# Altium schematic sheet mezza.SchDoc
size A1
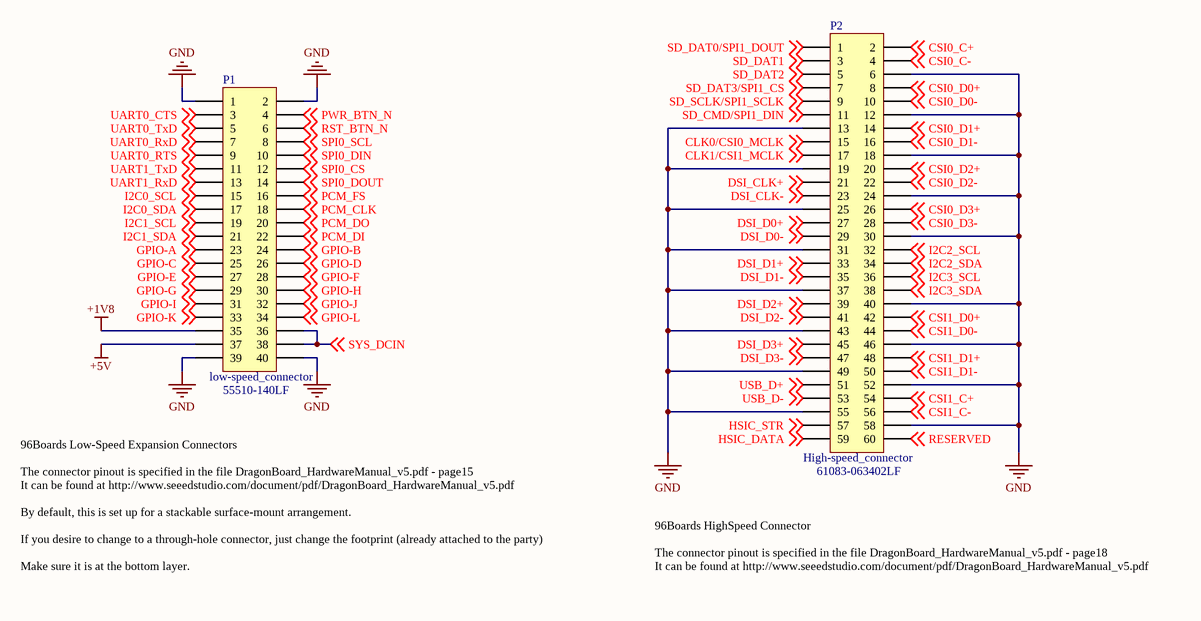
[diagram p0: mezza.SchDoc]

## Parts
P1  low-speed_connector  PartNumber: 55510-140LF  [low-speed_connector_TH]
P2  High-speed_connector  PartNumber: 61083-063402LF  [high-speed_connector]

## Nets
+1V8: P1.35
+5V: P1.37
GND: P1.1 P1.2 P1.39 P1.40 P2.6 P2.12 P2.13 P2.18 P2.19 P2.24 P2.25 P2.30 P2.31 P2.37 P2.40 P2.43 P2.46 P2.49 P2.52 P2.55 P2.58
CLK0/CSI0_MCLK: P2.15 ; off-sheet CLK0/CSI0_MCLK
CLK1/CSI1_MCLK: P2.17 ; off-sheet CLK1/CSI1_MCLK
CSI0_C+: P2.2 ; off-sheet CSI0_C+
CSI0_C-: P2.4 ; off-sheet CSI0_C-
CSI0_D0+: P2.8 ; off-sheet CSI0_D0+
CSI0_D0-: P2.10 ; off-sheet CSI0_D0-
CSI0_D1+: P2.14 ; off-sheet CSI0_D1+
CSI0_D1-: P2.16 ; off-sheet CSI0_D1-
CSI0_D2+: P2.20 ; off-sheet CSI0_D2+
CSI0_D2-: P2.22 ; off-sheet CSI0_D2-
CSI0_D3+: P2.26 ; off-sheet CSI0_D3+
CSI0_D3-: P2.28 ; off-sheet CSI0_D3-
CSI1_C+: P2.54 ; off-sheet CSI1_C+
CSI1_C-: P2.56 ; off-sheet CSI1_C-
CSI1_D0+: P2.42 ; off-sheet CSI1_D0+
CSI1_D0-: P2.44 ; off-sheet CSI1_D0-
CSI1_D1+: P2.48 ; off-sheet CSI1_D1+
CSI1_D1-: P2.50 ; off-sheet CSI1_D1-
DSI_CLK+: P2.21 ; off-sheet DSI_CLK+
DSI_CLK-: P2.23 ; off-sheet DSI_CLK-
DSI_D0+: P2.27 ; off-sheet DSI_D0+
DSI_D0-: P2.29 ; off-sheet DSI_D0-
DSI_D1+: P2.33 ; off-sheet DSI_D1+
DSI_D1-: P2.35 ; off-sheet DSI_D1-
DSI_D2+: P2.39 ; off-sheet DSI_D2+
DSI_D2-: P2.41 ; off-sheet DSI_D2-
DSI_D3+: P2.45 ; off-sheet DSI_D3+
DSI_D3-: P2.47 ; off-sheet DSI_D3-
GPIO-A: P1.23 ; off-sheet GPIO-A
GPIO-B: P1.24 ; off-sheet GPIO-B
GPIO-C: P1.25 ; off-sheet GPIO-C
GPIO-D: P1.26 ; off-sheet GPIO-D
GPIO-E: P1.27 ; off-sheet GPIO-E
GPIO-F: P1.28 ; off-sheet GPIO-F
GPIO-G: P1.29 ; off-sheet GPIO-G
GPIO-H: P1.30 ; off-sheet GPIO-H
GPIO-I: P1.31 ; off-sheet GPIO-I
GPIO-J: P1.32 ; off-sheet GPIO-J
GPIO-K: P1.33 ; off-sheet GPIO-K
GPIO-L: P1.34 ; off-sheet GPIO-L
HSIC_DATA: P2.59 ; off-sheet HSIC_DATA
HSIC_STR: P2.39(57) ; off-sheet HSIC_STR
I2C0_SCL: P1.15 ; off-sheet I2C0_SCL
I2C0_SDA: P1.17 ; off-sheet I2C0_SDA
I2C1_SCL: P1.19 ; off-sheet I2C1_SCL
I2C1_SDA: P1.21 ; off-sheet I2C1_SDA
I2C2_SCL: P2.32 ; off-sheet I2C2_SCL
I2C2_SDA: P2.34 ; off-sheet I2C2_SDA
I2C3_SCL: P2.36 ; off-sheet I2C3_SCL
I2C3_SDA: P2.38 ; off-sheet I2C3_SDA
PCM_CLK: P1.18 ; off-sheet PCM_CLK
PCM_DI: P1.22 ; off-sheet PCM_DI
PCM_DO: P1.20 ; off-sheet PCM_DO
PCM_FS: P1.16 ; off-sheet PCM_FS
PWR_BTN_N: P1.4 ; off-sheet PWR_BTN_N
RESERVED: P2.38(60) ; off-sheet RESERVED
RST_BTN_N: P1.6 ; off-sheet RST_BTN_N
SD_CMD/SPI1_DIN: P2.11 ; off-sheet SD_CMD/SPI1_DIN
SD_DAT0/SPI1_DOUT: P2.1 ; off-sheet SD_DAT0/SPI1_DOUT
SD_DAT1: P2.3 ; off-sheet SD_DAT1
SD_DAT2: P2.5 ; off-sheet SD_DAT2
SD_DAT3/SPI1_CS: P2.7 ; off-sheet SD_DAT3/SPI1_CS
SD_SCLK/SPI1_SCLK: P2.9 ; off-sheet SD_SCLK/SPI1_SCLK
SPI0_CS: P1.12 ; off-sheet SPI0_CS
SPI0_DIN: P1.10 ; off-sheet SPI0_DIN
SPI0_DOUT: P1.14 ; off-sheet SPI0_DOUT
SPI0_SCL: P1.8 ; off-sheet SPI0_SCL
SYS_DCIN: P1.36 P1.38 ; off-sheet SYS_DCIN
UART0_CTS: P1.3 ; off-sheet UART0_CTS
UART0_RTS: P1.9 ; off-sheet UART0_RTS
UART0_RxD: P1.7 ; off-sheet UART0_RxD
UART0_TxD: P1.5 ; off-sheet UART0_TxD
UART1_RxD: P1.13 ; off-sheet UART1_RxD
UART1_TxD: P1.11 ; off-sheet UART1_TxD
USB_D+: P2.51 ; off-sheet USB_D+
USB_D-: P2.53 ; off-sheet USB_D-

## Notes on the sheet
- 96Boards Low-Speed Expansion Connectors
  The connector pinout is specified in the file DragonBoard_HardwareManual_v5.pdf - page15
  It can be found at http://www.seeedstudio.com/document/pdf/DragonBoard_HardwareManual_v5.pdf
  By default, this is set up for a stackable surface-mount arrangement.
  If you desire to change to a through-hole connector, just change the footprint (already attached to the party)
  Make sure it is at the bottom layer.
- 96Boards HighSpeed Connector
  The connector pinout is specified in the file DragonBoard_HardwareManual_v5.pdf - page18
  It can be found at http://www.seeedstudio.com/document/pdf/DragonBoard_HardwareManual_v5.pdf

## Library data of the parts
P1 = low-speed_connector: Supplier 1: Digi-Key; Supplier Part Number 1: 609-2696-ND
P2 = High-speed_connector: Supplier 1: Digi-Key; Supplier Part Number 1: 609-1679-2-ND